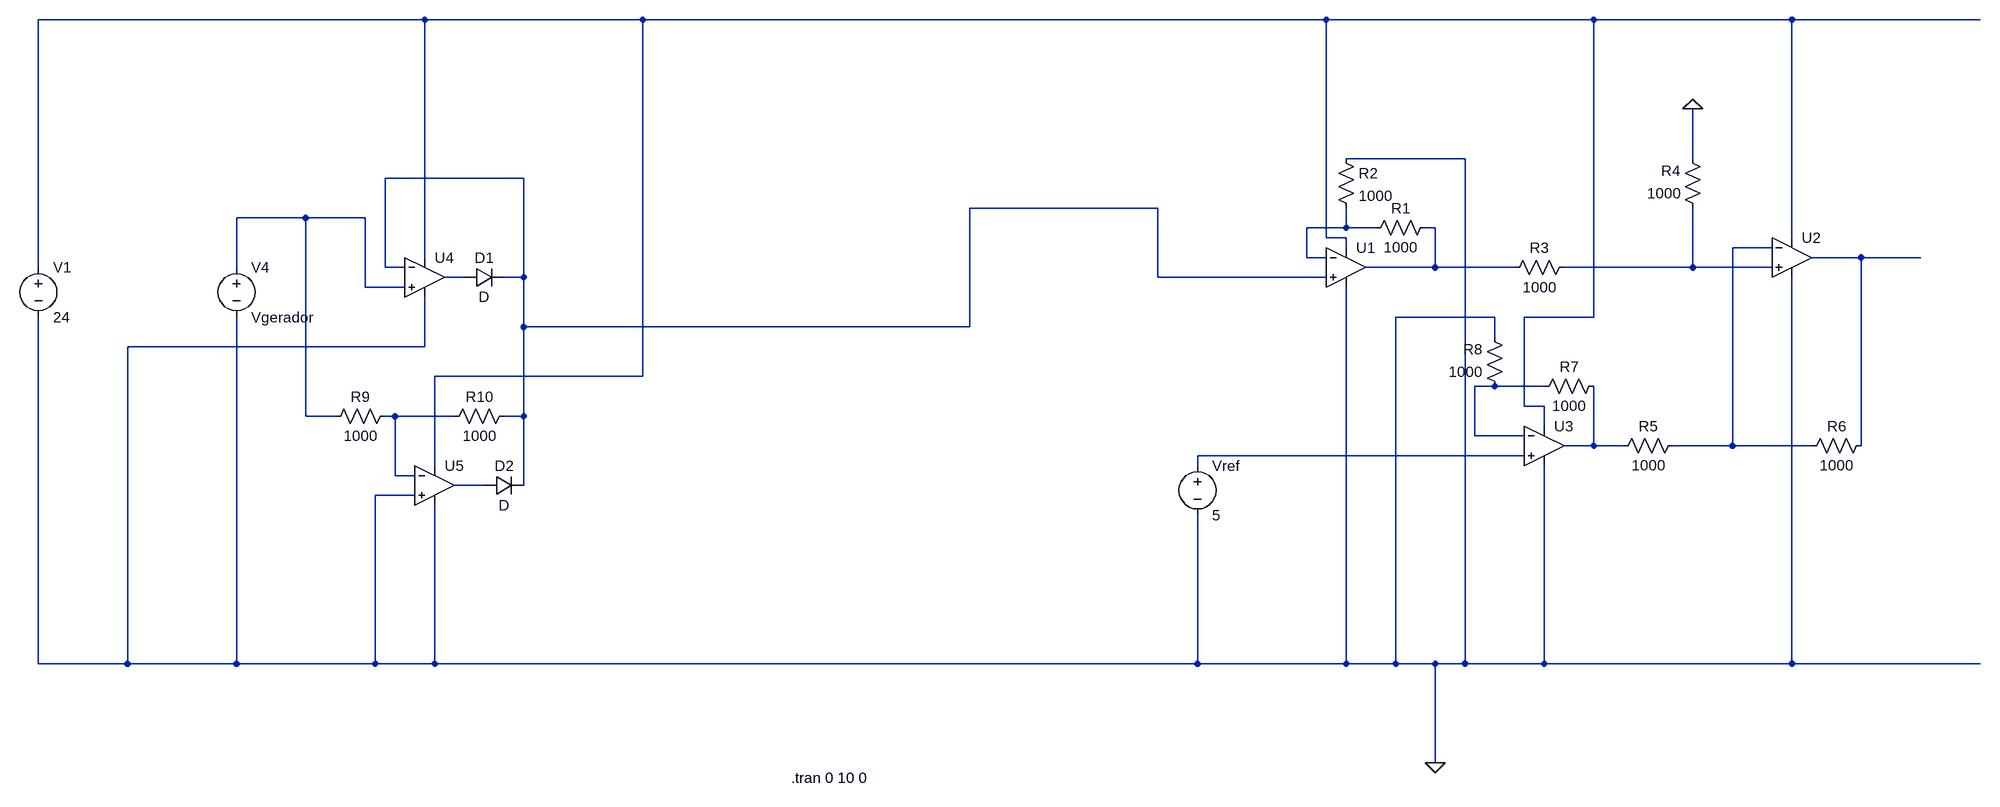
[diagram p0: schematic Control_circuit_schematic_V1.asc]
Control_circuit_schematic_V1.asc, the LTspice schematic file:
Version 4
SHEET 1 1316 920
WIRE -1200 -320 -1824 -320
WIRE -848 -320 -1200 -320
WIRE 256 -320 -848 -320
WIRE 688 -320 256 -320
WIRE 1008 -320 688 -320
WIRE 1312 -320 1008 -320
WIRE 480 -96 288 -96
WIRE 848 -96 848 -176
WIRE -1040 -64 -1264 -64
WIRE -16 -16 -320 -16
WIRE -1392 0 -1504 0
WIRE -1296 0 -1392 0
WIRE 288 16 288 -16
WIRE 288 16 224 16
WIRE 336 16 288 16
WIRE 432 16 416 16
WIRE 256 32 256 -320
WIRE 288 32 256 32
WIRE 1008 32 1008 -320
WIRE 288 48 288 32
WIRE 976 48 912 48
WIRE -1200 64 -1200 -320
WIRE 224 64 224 16
WIRE 256 64 224 64
WIRE 1120 64 1040 64
WIRE 1216 64 1120 64
WIRE -1824 80 -1824 -320
WIRE -1504 80 -1504 0
WIRE -1264 80 -1264 -64
WIRE -1232 80 -1264 80
WIRE 432 80 432 16
WIRE 432 80 320 80
WIRE 560 80 432 80
WIRE 848 80 848 -16
WIRE 848 80 640 80
WIRE 976 80 848 80
WIRE -1136 96 -1168 96
WIRE -1040 96 -1040 -64
WIRE -1040 96 -1072 96
WIRE -16 96 -16 -16
WIRE 256 96 -16 96
WIRE -1296 112 -1296 0
WIRE -1232 112 -1296 112
WIRE 528 160 368 160
WIRE 688 160 688 -320
WIRE 688 160 576 160
WIRE -1040 176 -1040 96
WIRE -320 176 -320 -16
WIRE -320 176 -1040 176
WIRE 528 192 528 160
WIRE -1200 208 -1200 128
WIRE -1200 208 -1680 208
WIRE -848 256 -848 -320
WIRE -848 256 -1184 256
WIRE 528 272 496 272
WIRE 608 272 528 272
WIRE 576 304 576 160
WIRE 608 304 576 304
WIRE -1392 320 -1392 0
WIRE -1344 320 -1392 320
WIRE -1248 320 -1264 320
WIRE -1152 320 -1248 320
WIRE -1040 320 -1040 176
WIRE -1040 320 -1072 320
WIRE 608 336 608 304
WIRE 496 352 496 272
WIRE 576 352 496 352
WIRE 688 368 688 272
WIRE 688 368 640 368
WIRE 736 368 688 368
WIRE 912 368 912 48
WIRE 912 368 816 368
WIRE 1040 368 912 368
WIRE 1120 368 1120 64
WIRE 576 384 48 384
WIRE -1184 400 -1184 256
WIRE 48 400 48 384
WIRE -1248 416 -1248 320
WIRE -1216 416 -1248 416
WIRE -1104 432 -1152 432
WIRE -1040 432 -1040 320
WIRE -1216 448 -1280 448
WIRE -1824 720 -1824 160
WIRE -1680 720 -1680 208
WIRE -1680 720 -1824 720
WIRE -1504 720 -1504 160
WIRE -1504 720 -1680 720
WIRE -1280 720 -1280 448
WIRE -1280 720 -1504 720
WIRE -1184 720 -1184 464
WIRE -1184 720 -1280 720
WIRE 48 720 48 480
WIRE 48 720 -1184 720
WIRE 288 720 288 112
WIRE 288 720 48 720
WIRE 368 720 368 160
WIRE 368 720 288 720
WIRE 432 720 368 720
WIRE 480 720 480 -96
WIRE 480 720 432 720
WIRE 608 720 608 400
WIRE 608 720 480 720
WIRE 1008 720 1008 96
WIRE 1008 720 608 720
WIRE 1312 720 1008 720
WIRE 432 880 432 720
FLAG 432 880 0
FLAG 848 -176 0
DATAFLAG -224 -16 ""
DATAFLAG -1504 16 ""
DATAFLAG 464 80 ""
DATAFLAG 784 80 ""
DATAFLAG 1184 64 ""
SYMBOL Opamps\\UniversalOpamp2 288 80 R0
SYMATTR InstName U1
SYMBOL res 432 0 R90
WINDOW 0 0 56 VBottom 2
WINDOW 3 32 56 VTop 2
SYMATTR InstName R1
SYMATTR Value 1000
SYMBOL res 272 -112 R0
SYMATTR InstName R2
SYMATTR Value 1000
SYMBOL res 656 64 R90
WINDOW 0 0 56 VBottom 2
WINDOW 3 32 56 VTop 2
SYMATTR InstName R3
SYMATTR Value 1000
SYMBOL res 864 0 R180
WINDOW 0 36 76 Left 2
WINDOW 3 36 40 Left 2
SYMATTR InstName R4
SYMATTR Value 1000
SYMBOL res 720 384 R270
WINDOW 0 32 56 VTop 2
WINDOW 3 0 56 VBottom 2
SYMATTR InstName R5
SYMATTR Value 1000
SYMBOL res 1024 384 R270
WINDOW 0 32 56 VTop 2
WINDOW 3 0 56 VBottom 2
SYMATTR InstName R6
SYMATTR Value 1000
SYMBOL Opamps\\UniversalOpamp2 1008 64 R0
SYMATTR InstName U2
SYMBOL Opamps\\UniversalOpamp2 608 368 R0
SYMATTR InstName U3
SYMBOL voltage 48 384 R0
WINDOW 123 0 0 Left 0
WINDOW 39 0 0 Left 0
SYMATTR InstName Vref
SYMATTR Value 5
SYMBOL res 704 256 R90
WINDOW 0 0 56 VBottom 2
WINDOW 3 32 56 VTop 2
SYMATTR InstName R7
SYMATTR Value 1000
SYMBOL res 544 288 R180
WINDOW 0 36 76 Left 2
WINDOW 3 36 40 Left 2
SYMATTR InstName R8
SYMATTR Value 1000
SYMBOL voltage -1824 64 R0
WINDOW 123 0 0 Left 0
WINDOW 39 0 0 Left 0
SYMATTR InstName V1
SYMATTR Value 24
SYMBOL Opamps\\UniversalOpamp2 -1200 96 R0
SYMATTR InstName U4
SYMBOL Opamps\\UniversalOpamp2 -1184 432 R0
SYMATTR InstName U5
SYMBOL res -1248 304 R90
WINDOW 0 0 56 VBottom 2
WINDOW 3 32 56 VTop 2
SYMATTR InstName R9
SYMATTR Value 1000
SYMBOL res -1056 304 R90
WINDOW 0 0 56 VBottom 2
WINDOW 3 32 56 VTop 2
SYMATTR InstName R10
SYMATTR Value 1000
SYMBOL diode -1136 112 R270
WINDOW 0 32 32 VTop 2
WINDOW 3 0 32 VBottom 2
SYMATTR InstName D1
SYMBOL diode -1104 448 R270
WINDOW 0 32 32 VTop 2
WINDOW 3 0 32 VBottom 2
SYMATTR InstName D2
SYMBOL voltage -1504 64 R0
WINDOW 123 0 0 Left 0
WINDOW 39 0 0 Left 0
SYMATTR InstName V4
SYMATTR Value Vgerador
TEXT -608 904 Left 2 !.tran 0 10 0

The netlist it stands for:
* Control_circuit_schematic_V1.asc
XU1 N002 N004 N001 0 N005 level.2 Avol=1Meg GBW=10Meg Slew=10Meg ilimit=25m rail=0 Vos=0 phimargin=45 en=0 enk=0 in=0 ink=0 Rin=500Meg  ; pins IN+ IN- V+ V- OUT
R1 N005 N004 1000
R2 0 N004 1000
R3 N008 N005 1000
R4 N008 0 1000
R5 N012 N006 1000
R6 N006 N007 1000
XU2 N008 N006 N001 0 N007 level.2 Avol=1Meg GBW=10Meg Slew=10Meg ilimit=25m rail=0 Vos=0 phimargin=45 en=0 enk=0 in=0 ink=0 Rin=500Meg  ; pins IN+ IN- V+ V- OUT
XU3 N013 N010 N001 0 N012 level.2 Avol=1Meg GBW=10Meg Slew=10Meg ilimit=25m rail=0 Vos=0 phimargin=45 en=0 enk=0 in=0 ink=0 Rin=500Meg  ; pins IN+ IN- V+ V- OUT
Vref N013 0 5
R7 N012 N010 1000
R8 N010 0 1000
V1 N001 0 24
XU4 N003 N002 N001 0 N009 level.2 Avol=1Meg GBW=10Meg Slew=10Meg ilimit=25m rail=0 Vos=0 phimargin=45 en=0 enk=0 in=0 ink=0 Rin=500Meg  ; pins IN+ IN- V+ V- OUT
XU5 0 N011 N001 0 N014 level.2 Avol=1Meg GBW=10Meg Slew=10Meg ilimit=25m rail=0 Vos=0 phimargin=45 en=0 enk=0 in=0 ink=0 Rin=500Meg  ; pins IN+ IN- V+ V- OUT
R9 N011 N003 1000
R10 N002 N011 1000
D1 N009 N002 D
D2 N014 N002 D
V4 N003 0 Vgerador
.model D D
.lib standard.dio
.tran 0 10 0
.lib UniversalOpamps2.sub
.backanno
.end